# Altium schematic sheet Sheet1.SchDoc
size A4; SheetNumber: 1; SheetTotal: 1; SPICEModelCacheHKQHZQKM: <root> / <DocumentId>HKQHZQKM</DocumentId> / </root>
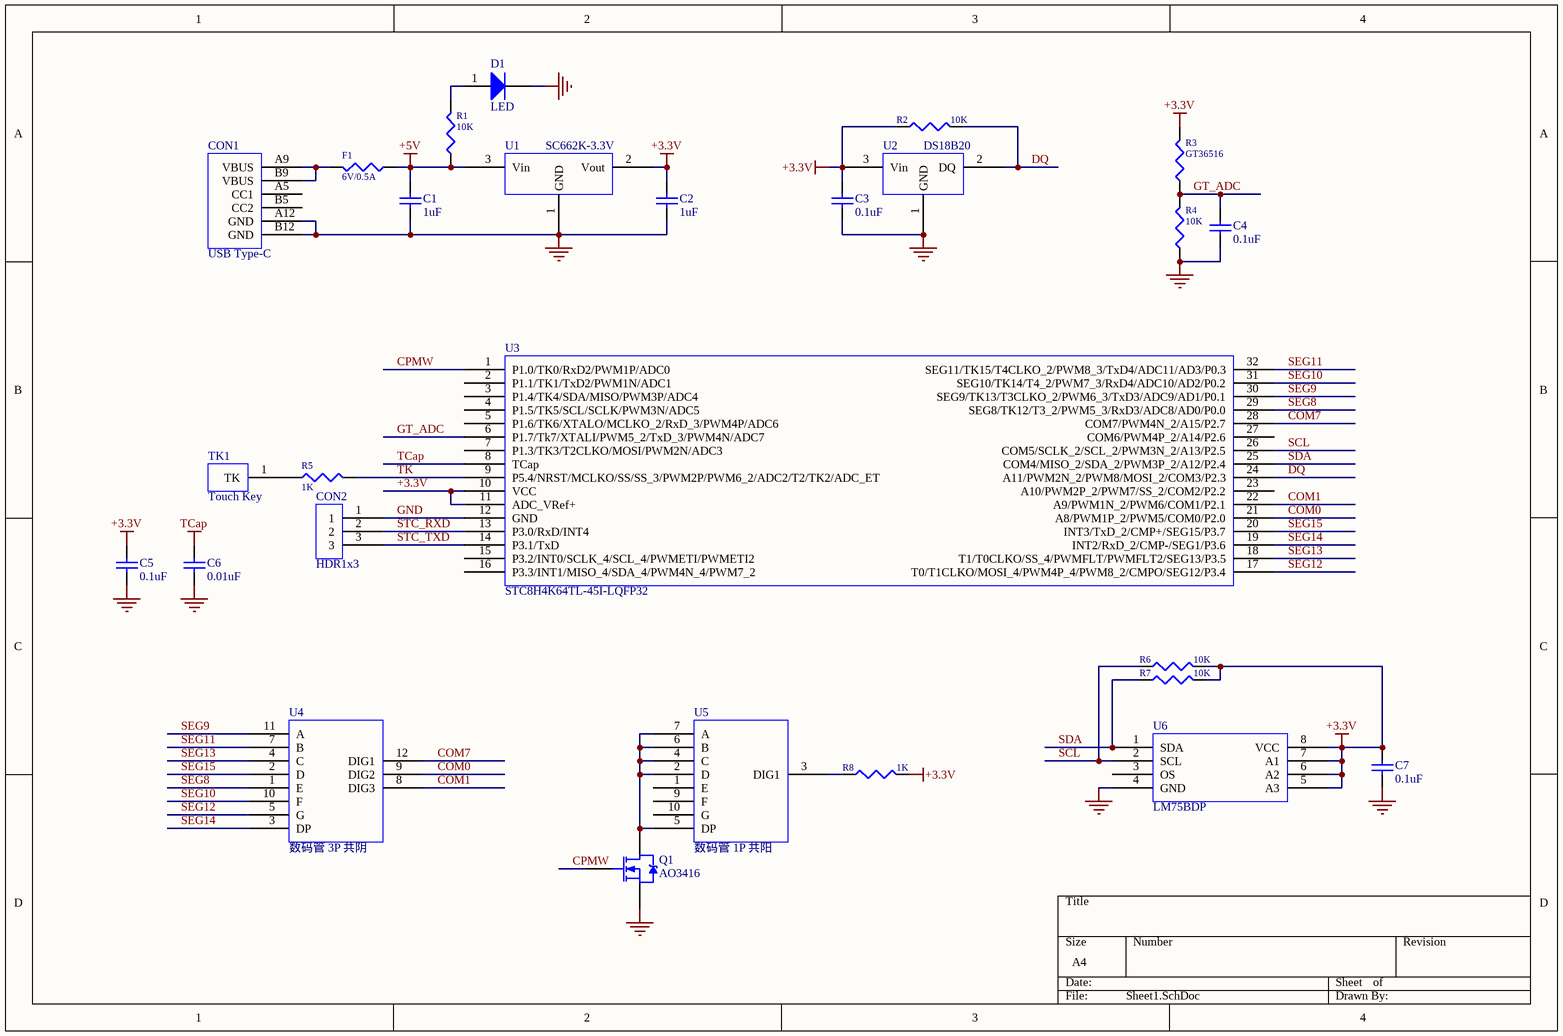
[diagram p0: Sheet1.SchDoc]

## Parts
C1  1uF  [0603_C]
C2  1uF  [0603_C]
C3  0.1uF  [0603_C]
C4  0.1uF  [0603_C]
C5  0.1uF  [0603_C]
C6  0.01uF  [0603_C]
C7  0.1uF  [0603_C]
CON1  USB Type-C  [Type-C 6P]
CON2  HDR1x3  [HDR1x3]
D1  LED  [0603_LED_S1]
F1  6V/0.5A  [0603_L]
Q1  AO3416  [SOT-23(SOT-23-3)]
R1  10K  [0603_R]
R2  10K  [0603_R]
R3  GT36516  [1210_R]
R4  10K  [0603_R]
R5  1K  [0603_R]
R6  10K  [0603_R]
R7  10K  [0603_R]
R8  1K  [0603_R]
TK1  Touch Key  [TouchKeyD6]
U1  SC662K-3.3V  [SOT-23(SOT-23-3)]
U2  DS18B20  [TO-92(TO-92-3)]
U3  STC8H4K64TL-45I-LQFP32  [LQFP-32_7x7x08P]
U4  数码管 3P 共阴  [0.56寸 3位]
U5  数码管 1P 共阳  [0.56寸 1位]
U6  LM75BDP  [MSOP-8]

## Nets
+3.3V: C2.2 C3.2 C5.2 C7.2 R2.2(BOT) R3.1(TOP) R6.1(TOP) R7.1(TOP) R8.1(TOP) U1.2(Vout) U2.3(Vin) U3.10(VCC) U3.11(ADC_VRef+) U6.5(A3) U6.6(A2) U6.7(A1) U6.8(VCC)
+5V: C1.2 F1.2(BOT) R1.2(BOT) U1.3(Vin)
GND: C1.1 C2.1 C3.1 C4.1 C5.1 C6.1 C7.1 CON1.A12(GND) CON1.B12(GND) CON2.1 D1.2(K) Q1.2(S) R4.2(BOT) U1.1(GND) U2.1(GND) U3.12(GND) U6.4(GND)
TCap: C6.2 U3.8(TCap)
COM0: U3.21(A8/PWM1P_2/PWM5/COM0/P2.0) U4.9(DIG2)
COM1: U3.22(A9/PWM1N_2/PWM6/COM1/P2.1) U4.8(DIG3)
COM7: U3.28(COM7/PWM4N_2/A15/P2.7) U4.12(DIG1)
CPMW: Q1.1(G) U3.1(P1.0/TK0/RxD2/PWM1P/ADC0)
DQ: R2.1(TOP) U2.2(DQ) U3.24(A11/PWM2N_2/PWM8/MOSI_2/COM3/P2.3)
GT_ADC: C4.2 R3.2(BOT) R4.1(TOP) U3.6(P1.7/Tk7/XTALI/PWM5_2/TxD_3/PWM4N/ADC7)
SCL: R6.2(BOT) U3.26(COM5/SCLK_2/SCL_2/PWM3N_2/A13/P2.5) U6.2(SCL)
SDA: R7.2(BOT) U3.25(COM4/MISO_2/SDA_2/PWM3P_2/A12/P2.4) U6.1(SDA)
SEG8: U3.29(SEG8/TK12/T3_2/PWM5_3/RxD3/ADC8/AD0/P0.0) U4.1(E)
SEG9: U3.30(SEG9/TK13/T3CLKO_2/PWM6_3/TxD3/ADC9/AD1/P0.1) U4.11(A)
SEG10: U3.31(SEG10/TK14/T4_2/PWM7_3/RxD4/ADC10/AD2/P0.2) U4.10(F)
SEG11: U3.32(SEG11/TK15/T4CLKO_2/PWM8_3/TxD4/ADC11/AD3/P0.3) U4.7(B)
SEG12: U3.17(T0/T1CLKO/MOSI_4/PWM4P_4/PWM8_2/CMPO/SEG12/P3.4) U4.5(G)
SEG13: U3.18(T1/T0CLKO/SS_4/PWMFLT/PWMFLT2/SEG13/P3.5) U4.4(C)
SEG14: U3.19(INT2/RxD_2/CMP-/SEG1/P3.6) U4.3(DP)
SEG15: U3.20(INT3/TxD_2/CMP+/SEG15/P3.7) U4.2(D)
STC_RXD: CON2.2 U3.13(P3.0/RxD/INT4)
STC_TXD: CON2.3 U3.14(P3.1/TxD)
TK: R5.1(TOP) U3.9(P5.4/NRST/MCLKO/SS/SS_3/PWM2P/PWM6_2/ADC2/T2/TK2/ADC_ET)
NetCON1_A9: CON1.A9(VBUS) CON1.B9(VBUS) F1.1(TOP)
NetD1_1: D1.1(A) R1.1(TOP)
NetQ1_3: Q1.3(D) U5.2(D) U5.4(C) U5.5(DP) U5.6(B) U5.7(A)
NetR5_2: R5.2(BOT) TK1.1(TK)
NetR8_2: R8.2(BOT) U5.3(DIG1)

Not connected (* = marked no-connect by the designer): CON1 A5(CC1) B5(CC2); U3 2(P1.1/TK1/TxD2/PWM1N/ADC1) 3(P1.4/TK4/SDA/MISO/PWM3P/ADC4) 4(P1.5/TK5/SCL/SCLK/PWM3N/ADC5) 5(P1.6/TK6/XTALO/MCLKO_2/RxD_3/PWM4P/ADC6) 7(P1.3/TK3/T2CLKO/MOSI/PWM2N/ADC3) 15(P3.2/INT0/SCLK_4/SCL_4/PWMETI/PWMETI2) 16(P3.3/INT1/MISO_4/SDA_4/PWM4N_4/PWM7_2) 23(A10/PWM2P_2/PWM7/SS_2/COM2/P2.2) 27(COM6/PWM4P_2/A14/P2.6); U5 1(E) 9(F) 10(G); U6 3(OS)

## Library data of the parts
C1-C7 = 0603 100nF (104) 10% 50V: 贴片电容; ComponentLink1Description: 供应商链接; ComponentLink1URL: http://www.szlcsc.com/product/details_15331.html; Package: 0603; Supplier: LC; SuppliersPartNumber: C14663
D1 = Diode: 二极管; Notepad: 1N4007 4007 编号C2464 已经停售, 使用新物料编号C95872; ComponentLink1Description: 供应商链接; ComponentLink1URL: http://www.szlcsc.com/product/details_2841.html; Package: SMA(DO-214AC); Supplier: LC; SuppliersPartNumber: C95872
F1 R1-R8 = RES: Resistor
Q1 = AO3416: N-Channel Power MOSFET; Note: Pin 4 not drawn and electrically connected to Pin 2.; Published: 8-Jun-2000; LatestRevisionDate: 17-Jul-2002; LatestRevisionNote: Re-released for DXP Platform.; DatasheetVersion: PD-9.390D; PackageVersion: Feb-1997; PackageReference: TO-220AB; Publisher: Altium Limited; PackageDescription: TO, Thru-Hole, Vertical, Heatsink Mounted; 3 In-Line Leads; Pitch 2.54 mm; ComponentLink1Description: Manufacturer Link; ComponentLink1URL: http://www.irf.com/
U1 = AMS1117 3.3V
U4 = 数码管 3P
U5 = 数码管 1P